# EasyEDA Pro project ProPrj_CyMouse.epro, board 侧键
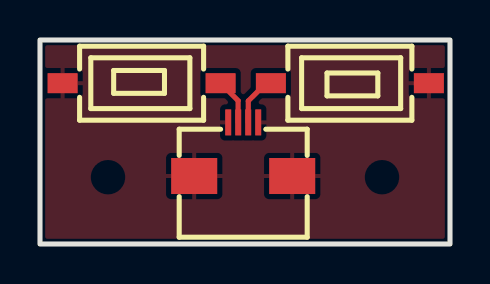
[diagram p3: board, top side]
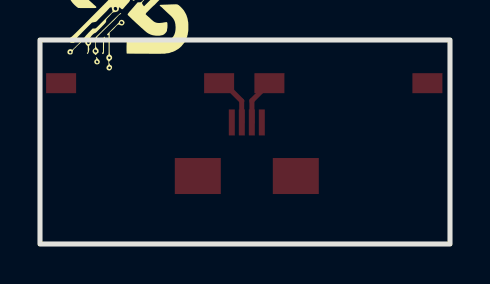
[diagram p4: board, bottom side, seen from below]

Outline 20.5 x 10.2 mm; copper layers: Top Layer, Bottom Layer. Coordinates in mm from the lower left corner of the outline.
Outline path: rectangle 0,10.2 20.5,0
Stack: Top Layer 0.035mm / Dielectric1 0.71mm FR4 er 4.5 / Bottom Layer 0.035mm

## Design rules (mm)
template: JLCPCB Capability(Two Layers Board)
spacing copperThickness1oz (default): track to track 0.102, other pairs 0.152 to 0.3
spacing copperThickness2oz: track to track 0.203, other pairs 0.152 to 0.3
track width copperThickness1oz (default): min 0.127, default 0.254, max 2.54
track width copperThickness2oz: min 0.203, default 0.254, max 2.54
differential pair differentialPair (default): width min 0.127, default 0.254, max 2.54; gap min 0.152, default 0.152
via viaSize (default): diameter min 0.5, default 0.61, max 10; hole min 0.3, default 0.305, max 6.3

## Placement (name value [footprint] x y rotation side)
FPC1  AFC01-S04FCC-00  [FFC-SMD_4P-P0.50_AFC01-S04FCC-00]  10.16 4.74 0 top
SW23  TS-1007S-AR02516  [SW-SMD_L6.1-W3.6-LS7.9]  5.08 8.04 0 top
SW24  TS-1007S-AR02516  [SW-SMD_L6.1-W3.6-LS7.9]  15.49 8.04 180 top

## Footprints (pads in the part's own frame, mm; a bottom-side part is the same pattern mirrored in y, then rotated)
FFC-SMD_4P-P0.50_AFC01-S04FCC-00
  rect 0.3x1.3 smd: 1(-0.75,1.34) 2(-0.25,1.34) 3(0.25,1.34) 4(0.75,1.34)
  rect 2.3x1.8 smd: 5(2.45,-1.34) 6(-2.45,-1.34)
SW-SMD_L6.1-W3.6-LS7.9
  rect 1.5x1 smd: 1(-3.95,0) 2(3.95,0)

## Nets
As in the schematic.

## Routing (per net, layer and track width the routed paths; a pad name or vN(x,y) marks a point on that pad's centre or on a via; arc(x,y) is an arc through that point)
$1N784: length 2.6
  Top Layer w0.254: FPC1.3 10.41,6.08 10.41,7.15 11.3,8.04 SW24.2
$1N789: length 2.3
  Top Layer w0.254: FPC1.2 9.91,6.08 9.91,7.17 SW23.2

## Copper pours and planes (outline as drawn; the poured copper is in the pictures)
GND on Top Layer: 0.13,10.07 20.32,10.07 20.32,0.17 0.13,0.17
